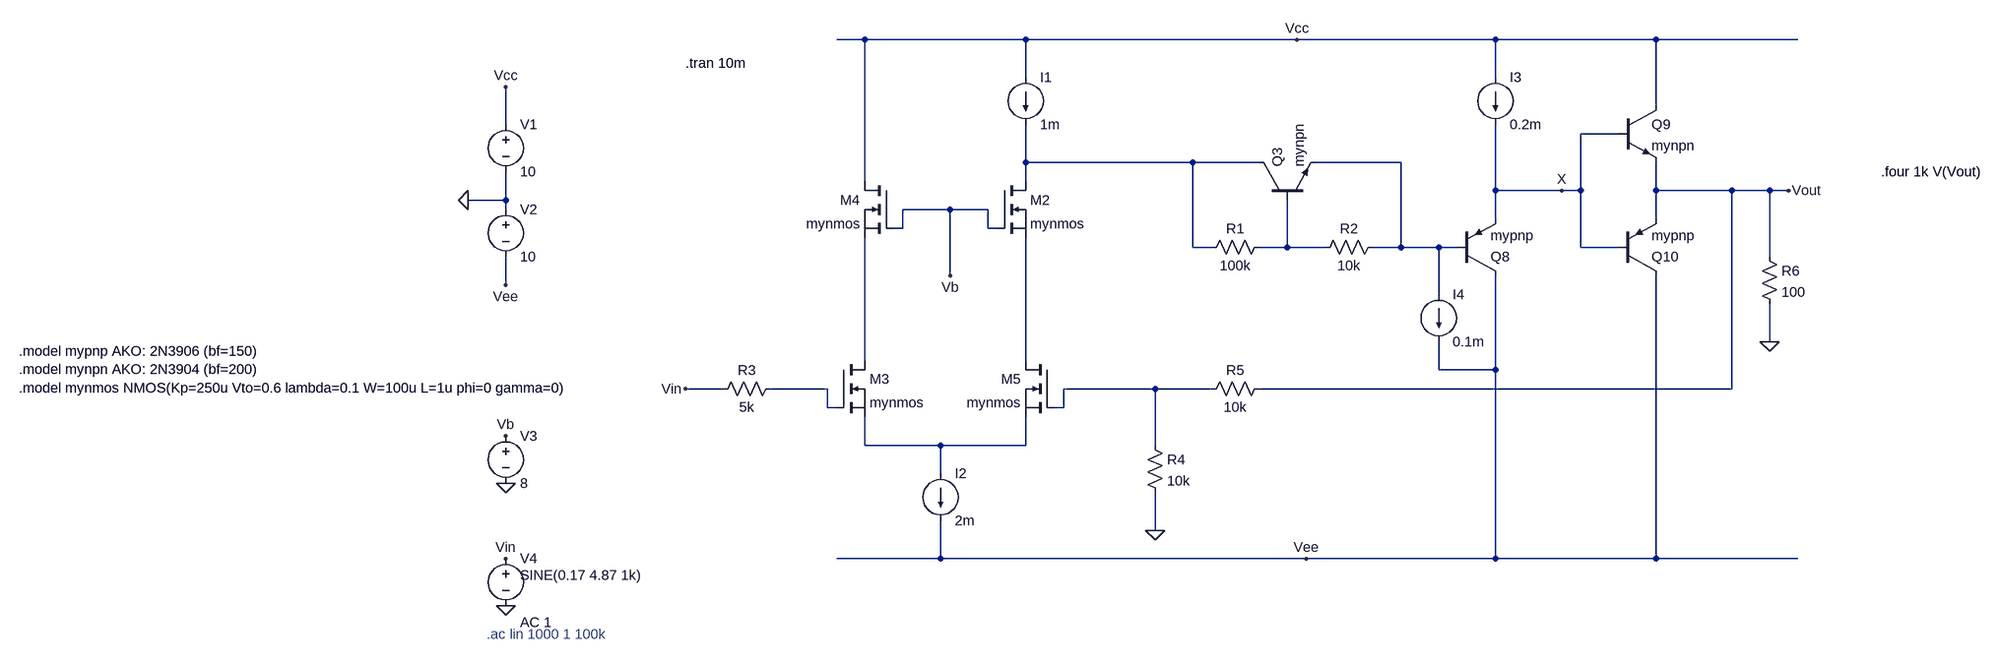
[diagram p0: schematic Analyzed circuit.asc]
Analyzed circuit.asc, the LTspice schematic file:
Version 4.1
SHEET 1 2252 1184
WIRE 224 160 176 160
WIRE 496 160 224 160
WIRE 960 160 496 160
WIRE 1296 160 960 160
WIRE 1568 160 1296 160
WIRE 1808 160 1568 160
WIRE 496 224 496 160
WIRE 1296 224 1296 160
WIRE 1568 272 1568 160
WIRE -384 304 -384 240
WIRE 1504 320 1440 320
WIRE 496 368 496 304
WIRE 784 368 496 368
WIRE 896 368 784 368
WIRE 1136 368 992 368
WIRE 224 400 224 160
WIRE 496 400 496 368
WIRE 1296 416 1296 304
WIRE 1408 416 1296 416
WIRE 1440 416 1440 320
WIRE 1440 416 1408 416
WIRE 1568 416 1568 368
WIRE 1696 416 1568 416
WIRE 1760 416 1696 416
WIRE 1792 416 1760 416
WIRE -384 432 -384 384
WIRE -384 432 -448 432
WIRE -384 448 -384 432
WIRE 368 448 288 448
WIRE 432 448 368 448
WIRE 1296 464 1296 416
WIRE 1568 464 1568 416
WIRE 288 480 288 448
WIRE 288 480 272 480
WIRE 432 480 432 448
WIRE 448 480 432 480
WIRE 784 512 784 368
WIRE 816 512 784 512
WIRE 944 512 944 432
WIRE 944 512 896 512
WIRE 1008 512 944 512
WIRE 1136 512 1136 368
WIRE 1136 512 1088 512
WIRE 1200 512 1136 512
WIRE 1232 512 1200 512
WIRE 1440 512 1440 416
WIRE 1504 512 1440 512
WIRE 1760 528 1760 416
WIRE 368 560 368 448
WIRE -384 576 -384 528
WIRE 1200 592 1200 512
WIRE 1760 672 1760 608
WIRE 224 704 224 496
WIRE 496 704 496 496
WIRE 1200 720 1200 672
WIRE 1296 720 1296 560
WIRE 1296 720 1200 720
WIRE -16 752 -80 752
WIRE 160 752 64 752
WIRE 720 752 560 752
WIRE 816 752 720 752
WIRE 1696 752 1696 416
WIRE 1696 752 896 752
WIRE 160 784 160 752
WIRE 176 784 160 784
WIRE 560 784 560 752
WIRE 560 784 544 784
WIRE 224 848 224 800
WIRE 352 848 224 848
WIRE 496 848 496 800
WIRE 496 848 352 848
WIRE 720 848 720 752
WIRE 352 896 352 848
WIRE 720 992 720 928
WIRE 352 1040 352 976
WIRE 352 1040 176 1040
WIRE 976 1040 352 1040
WIRE 1296 1040 1296 720
WIRE 1296 1040 976 1040
WIRE 1568 1040 1568 560
WIRE 1568 1040 1296 1040
WIRE 1808 1040 1568 1040
FLAG 720 992 0
FLAG 1760 672 0
FLAG -384 240 Vcc
FLAG -384 576 Vee
FLAG 960 160 Vcc
FLAG 976 1040 Vee
FLAG -384 912 0
FLAG -384 832 Vb
FLAG -448 432 0
FLAG 1792 416 Vout
FLAG -384 1120 0
FLAG -80 752 Vin
FLAG -384 1040 Vin
FLAG 368 560 Vb
FLAG 1408 416 X
SYMBOL current 496 224 R0
SYMATTR InstName I1
SYMATTR Value 1m
SYMBOL current 352 896 R0
SYMATTR InstName I2
SYMATTR Value 2m
SYMBOL res 912 496 R90
WINDOW 0 0 56 VBottom 2
WINDOW 3 32 56 VTop 2
SYMATTR InstName R1
SYMATTR Value 100k
SYMBOL res 1104 496 R90
WINDOW 0 0 56 VBottom 2
WINDOW 3 32 56 VTop 2
SYMATTR InstName R2
SYMATTR Value 10k
SYMBOL res 80 736 R90
WINDOW 0 0 56 VBottom 2
WINDOW 3 32 56 VTop 2
SYMATTR InstName R3
SYMATTR Value 5k
SYMBOL res 704 832 R0
SYMATTR InstName R4
SYMATTR Value 10k
SYMBOL res 912 736 R90
WINDOW 0 0 56 VBottom 2
WINDOW 3 32 56 VTop 2
SYMATTR InstName R5
SYMATTR Value 10k
SYMBOL current 1296 224 R0
SYMATTR InstName I3
SYMATTR Value 0.2m
SYMBOL pnp 1232 560 M180
SYMATTR InstName Q8
SYMATTR Value mypnp
SYMBOL current 1200 592 R0
SYMATTR InstName I4
SYMATTR Value 0.1m
SYMBOL npn 1504 272 R0
SYMATTR InstName Q9
SYMATTR Value mynpn
SYMBOL pnp 1504 560 M180
SYMATTR InstName Q10
SYMATTR Value mypnp
SYMBOL res 1744 512 R0
SYMATTR InstName R6
SYMATTR Value 100
SYMBOL voltage -384 288 R0
SYMATTR InstName V1
SYMATTR Value 10
SYMBOL voltage -384 432 R0
SYMATTR InstName V2
SYMATTR Value 10
SYMBOL voltage -384 816 R0
WINDOW 123 0 0 Left 0
WINDOW 39 0 0 Left 0
SYMATTR InstName V3
SYMATTR Value 8
SYMBOL voltage -384 1024 R0
WINDOW 123 24 124 Left 2
WINDOW 39 0 0 Left 0
WINDOW 3 24 44 Left 2
SYMATTR Value2 AC 1
SYMATTR Value SINE(0.17 4.87 1k)
SYMATTR InstName V4
SYMBOL nmos 448 400 R0
SYMATTR InstName M2
SYMATTR Value mynmos
SYMBOL nmos 176 704 R0
SYMATTR InstName M3
SYMATTR Value mynmos
SYMBOL nmos 272 400 M0
SYMATTR InstName M4
SYMATTR Value mynmos
SYMBOL nmos 544 704 M0
SYMATTR InstName M5
SYMATTR Value mynmos
SYMBOL npn 896 432 R270
SYMATTR InstName Q3
SYMATTR Value mynpn
TEXT -416 1168 Left 2 ;.ac lin 1000 1 100k
TEXT -80 200 Left 2 !.tran 10m
TEXT -1208 688 Left 2 !.model mypnp AKO: 2N3906 (bf=150)\n.model mynpn AKO: 2N3904 (bf=200)\n.model mynmos NMOS(Kp=250u Vto=0.6 lambda=0.1 W=100u L=1u phi=0 gamma=0)
TEXT 2064 384 Left 2 !.four 1k V(Vout)

The netlist it stands for:
* Analyzed circuit.asc
I1 Vcc N001 1m
I2 N008 Vee 2m
R1 N003 N001 100k
R2 N002 N003 10k
R3 N006 Vin 5k
R4 N007 0 10k
R5 Vout N007 10k
I3 Vcc X 0.2m
Q8 Vee N002 X 0 mypnp
I4 N002 Vee 0.1m
Q9 Vcc X Vout 0 mynpn
Q10 Vee X Vout 0 mypnp
R6 Vout 0 100
V1 Vcc 0 10
V2 0 Vee 10
V3 Vb 0 8
V4 Vin 0 SINE(0.17 4.87 1k) AC 1
M2 N001 Vb N005 N005 mynmos
M3 N004 N006 N008 N008 mynmos
M4 Vcc Vb N004 N004 mynmos
M5 N005 N007 N008 N008 mynmos
Q3 N001 N003 N002 0 mynpn
.model NPN NPN
.model PNP PNP
.lib standard.bjt
.model NMOS NMOS
.model PMOS PMOS
.lib standard.mos
* .ac lin 1000 1 100k
.tran 10m
.model mypnp AKO: 2N3906 (bf=150)
.model mynpn AKO: 2N3904 (bf=200)
.model mynmos NMOS(Kp=250u Vto=0.6 lambda=0.1 W=100u L=1u phi=0 gamma=0)
.four 1k V(Vout)
.backanno
.end